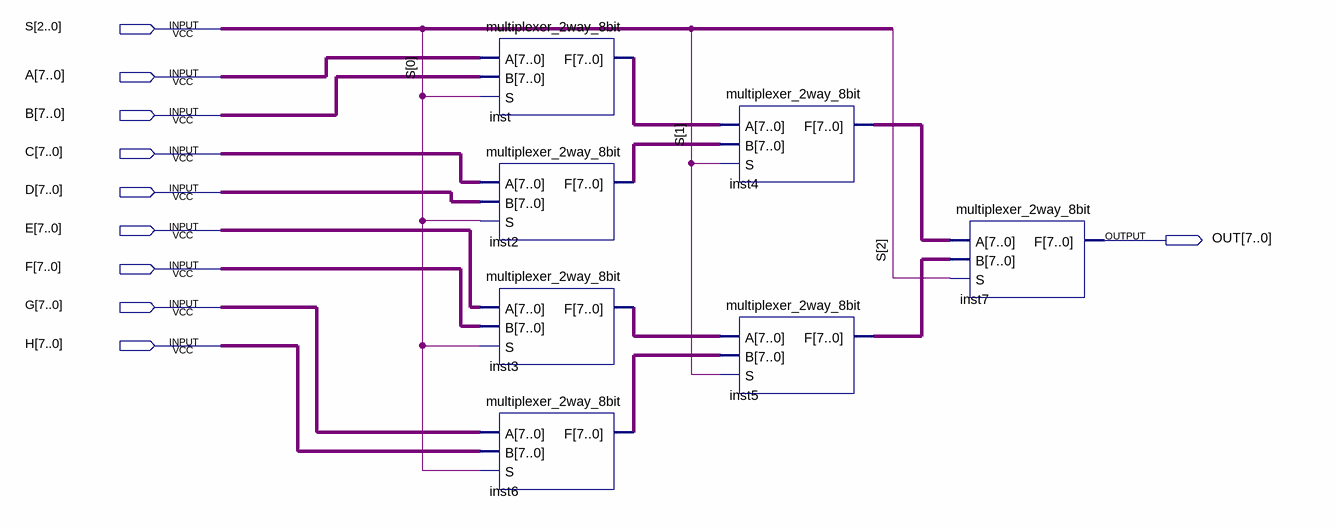
[diagram p0: schematic sheet]
// Quartus schematic multiplexer_8way_8bit.bdf as structural Verilog: 7 symbols, 10 pins
module multiplexer_8way_8bit (
  input  [2:0] S,
  input  [7:0] A,
  input  [7:0] B,
  input  [7:0] C,
  input  [7:0] D,
  input  [7:0] E,
  input  [7:0] F,
  input  [7:0] G,
  input  [7:0] H,
  output [7:0] OUT
);

  wire [7:0] inst2_f, inst3_f, inst4_f, inst5_f, inst6_f, inst_f;

  multiplexer_2way_8bit inst (.A(A), .B(B), .S(S[0]), .F(inst_f));
  multiplexer_2way_8bit inst2 (.A(C), .B(D), .S(S[0]), .F(inst2_f));
  multiplexer_2way_8bit inst3 (.A(E), .B(F), .S(S[0]), .F(inst3_f));
  multiplexer_2way_8bit inst6 (.A(G), .B(H), .S(S[0]), .F(inst6_f));
  multiplexer_2way_8bit inst4 (.A(inst_f), .B(inst2_f), .S(S[1]), .F(inst4_f));
  multiplexer_2way_8bit inst5 (.A(inst3_f), .B(inst6_f), .S(S[1]), .F(inst5_f));
  multiplexer_2way_8bit inst7 (.A(inst4_f), .B(inst5_f), .S(S[2]), .F(OUT));
endmodule
